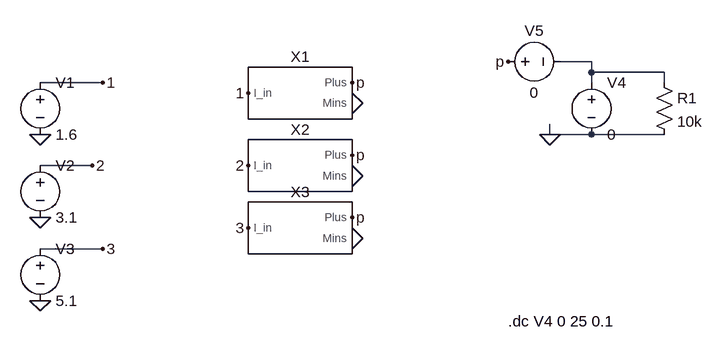
[diagram p0: schematic 1module.asc]
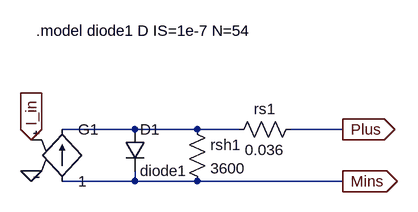
[diagram p1: sub-circuit module.asc]
1module.asc, the LTspice schematic file:
Version 4
SHEET 1 880 680
WIRE 672 16 624 16
WIRE 672 32 672 16
WIRE 784 32 672 32
WIRE -80 48 -176 48
WIRE 672 48 672 32
WIRE 784 48 784 32
WIRE 608 128 608 112
WIRE 672 128 608 128
WIRE 784 128 672 128
WIRE -96 176 -176 176
WIRE -80 304 -176 304
FLAG -176 128 0
FLAG -176 256 0
FLAG -176 384 0
FLAG -80 48 1
FLAG -96 176 2
FLAG -80 304 3
FLAG 144 64 1
FLAG 144 176 2
FLAG 144 272 3
FLAG 304 288 0
FLAG 304 192 0
FLAG 304 80 0
FLAG 608 128 0
FLAG 544 16 p
FLAG 304 48 p
FLAG 304 160 p
FLAG 304 256 p
SYMBOL voltage -176 32 R0
SYMATTR InstName V1
SYMATTR Value 1.6
SYMBOL voltage -176 160 R0
SYMATTR InstName V2
SYMATTR Value 3.1
SYMBOL voltage -176 288 R0
SYMATTR InstName V3
SYMATTR Value 5.1
SYMBOL module 224 64 R0
SYMATTR InstName X1
SYMBOL module 224 176 R0
SYMATTR InstName X2
SYMBOL module 224 272 R0
SYMATTR InstName X3
SYMBOL voltage 672 32 R0
WINDOW 123 0 0 Left 0
WINDOW 39 24 124 Left 2
SYMATTR InstName V4
SYMATTR Value 0
SYMBOL voltage 528 16 R270
WINDOW 0 32 56 VTop 2
WINDOW 3 -32 56 VBottom 2
SYMATTR InstName V5
SYMATTR Value 0
SYMBOL res 768 32 R0
SYMATTR InstName R1
SYMATTR Value 10k
TEXT 544 416 Left 2 !.dc V4 0 25 0.1

module.asc, the sub-circuit schematic file:
Version 4
SHEET 1 880 680
WIRE 128 64 16 64
WIRE 224 64 128 64
WIRE 288 64 224 64
WIRE 448 64 368 64
WIRE 128 144 128 128
WIRE 128 144 16 144
WIRE 224 144 128 144
WIRE 448 144 224 144
FLAG -32 128 0
FLAG -32 80 I_in
IOPIN -32 80 In
FLAG 448 64 Plus
IOPIN 448 64 Out
FLAG 448 144 Mins
IOPIN 448 144 Out
SYMBOL diode 112 64 R0
SYMATTR InstName D1
SYMATTR Value diode1
SYMBOL res 208 48 R0
SYMATTR InstName rsh1
SYMATTR Value 3600
SYMBOL res 384 48 R90
WINDOW 0 0 56 VBottom 2
WINDOW 3 32 56 VTop 2
SYMATTR InstName rs1
SYMATTR Value 0.036
SYMBOL g 16 48 R0
SYMATTR InstName G1
SYMATTR Value 1
TEXT -24 -88 Left 2 !.model diode1 D IS=1e-7 N=54

The netlist it stands for:
* 1module.asc
V1 1 0 1.6
V2 2 0 3.1
V3 3 0 5.1
XX1 1 p 0 module
XX2 2 p 0 module
XX3 3 p 0 module
V4 N001 0 0
V5 p N001 0
R1 N001 0 10k

* block symbol definitions
.subckt module I_in Plus Mins
D1 N001 Mins diode1
rsh1 N001 Mins 3600
rs1 Plus N001 0.036
G1 Mins N001 I_in 0 1
.model diode1 D IS=1e-7 N=54
.ends module

.model D D
.lib standard.dio
.dc V4 0 25 0.1
.backanno
.end